# Altium project PX4FMUv2.4.6.PrjPcb (part 2 of 2)

## Sheet PX4FMUv2.4.6_12.SchDoc: PX4FMUv2.4.6.sch
size 282 x 200 mm; Date: 2015/3/26 21:06:25; SheetNumber: Sheet:
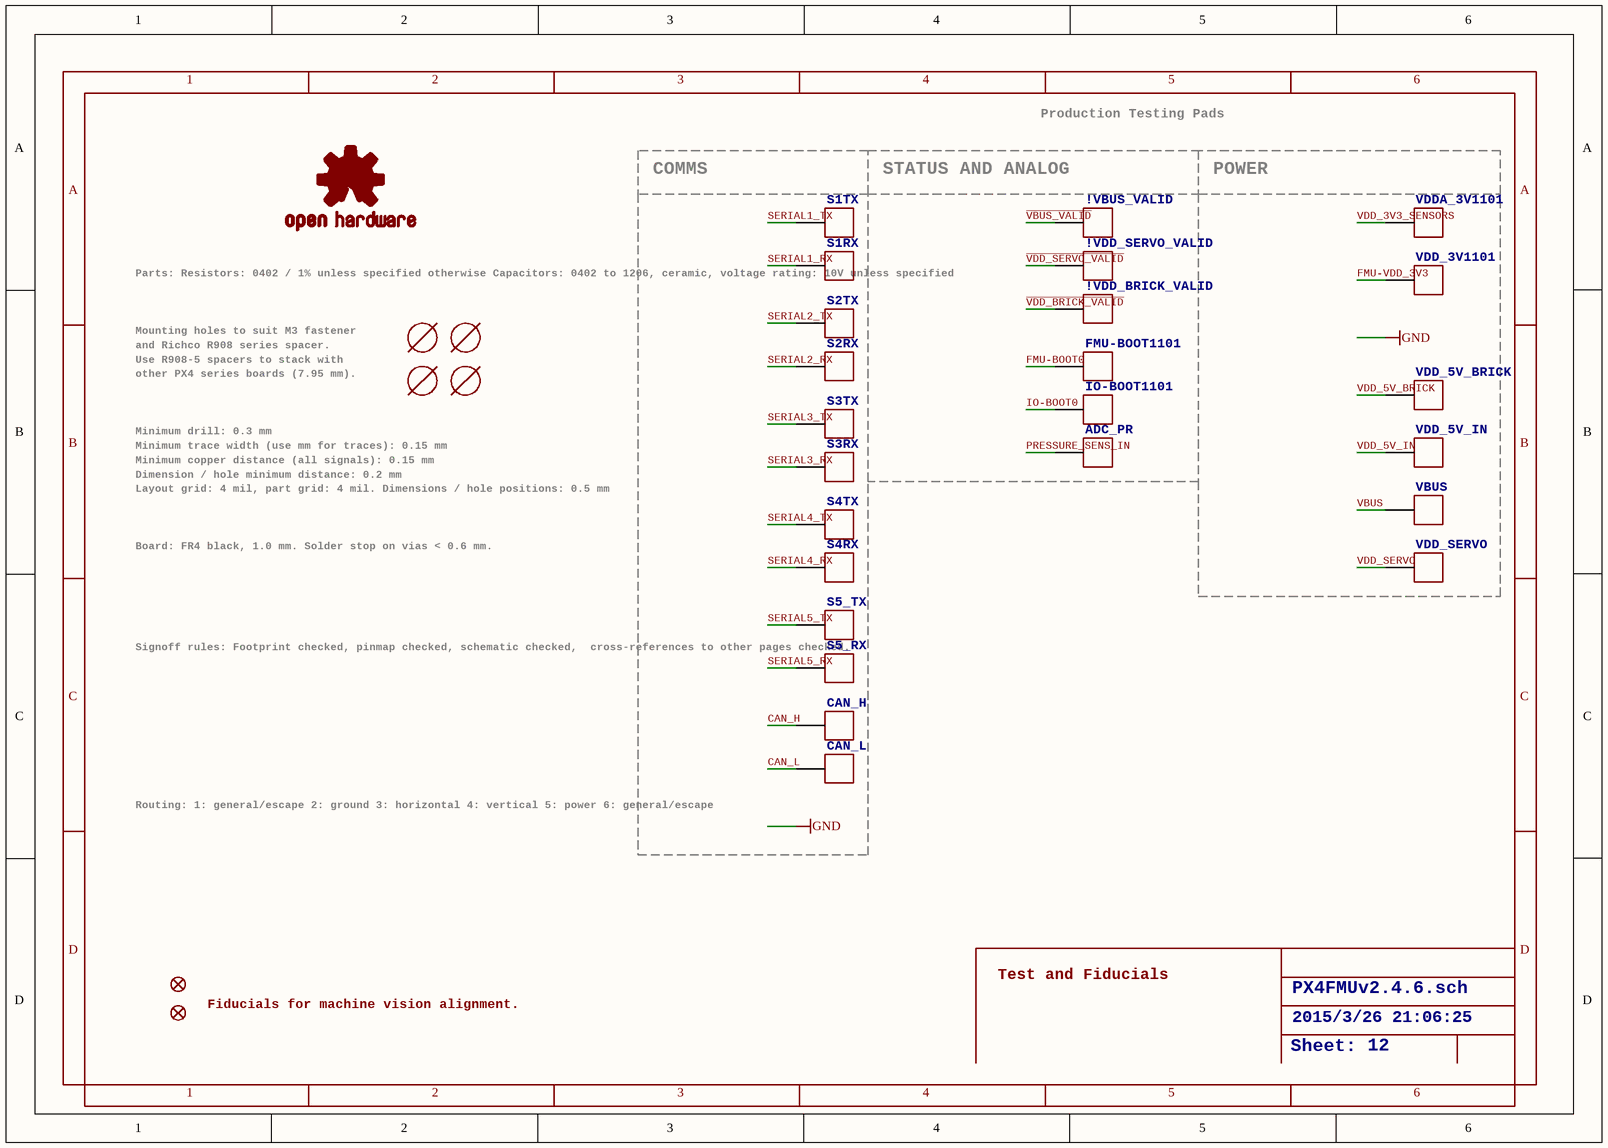
[diagram p11: PX4FMUv2.4.6_12.SchDoc]

### Parts
!VBUS_VALID  PAD.04  [PAD.04X.04]  (value not drawn)
!VDD_BRICK_VALID  PAD.04  [PAD.04X.04]  (value not drawn)
!VDD_SERVO_VALID  PAD.04  [PAD.04X.04]  (value not drawn)
ADC_PR  PAD.04  [PAD.04X.04]  (value not drawn)
CAN_H  PAD.04  [PAD.04X.04]  (value not drawn)
CAN_L  PAD.04  [PAD.04X.04]  (value not drawn)
FMU-BOOT1101  PAD.04  [PAD.04X.04]  (value not drawn)
IO-BOOT1101  PAD.04  [PAD.04X.04]  (value not drawn)
JP1  FIDUCIAL1.5X3  [FIDUCIAL-1.5X3]  (value not drawn)
JP2  FIDUCIAL1.5X3  [FIDUCIAL-1.5X3]  (value not drawn)
M3_MOUNT1101  MOUNT-HOLE3.1MM  [MOUNT-HOLE3.1]  (value not drawn)
M3_MOUNT1102  MOUNT-HOLE3.1MM  [MOUNT-HOLE3.1]  (value not drawn)
M3_MOUNT1103  MOUNT-HOLE3.1MM  [MOUNT-HOLE3.1]  (value not drawn)
M3_MOUNT1104  MOUNT-HOLE3.1MM  [MOUNT-HOLE3.1]  (value not drawn)
OSHW_LOGO  OSHW-LOGOS  [OSHW-LOGO-S]  (value not drawn)
S1RX  PAD.04  [PAD.04X.04]  (value not drawn)
S1TX  PAD.04  [PAD.04X.04]  (value not drawn)
S2RX  PAD.04  [PAD.04X.04]  (value not drawn)
S2TX  PAD.04  [PAD.04X.04]  (value not drawn)
S3RX  PAD.04  [PAD.04X.04]  (value not drawn)
S3TX  PAD.04  [PAD.04X.04]  (value not drawn)
S4RX  PAD.04  [PAD.04X.04]  (value not drawn)
S4TX  PAD.04  [PAD.04X.04]  (value not drawn)
S5_RX  PAD.04  [PAD.04X.04]  (value not drawn)
S5_TX  PAD.04  [PAD.04X.04]  (value not drawn)
VBUS  PAD.04  [PAD.04X.04]  (value not drawn)
VDD_3V1101  PAD.04  [PAD.04X.04]  (value not drawn)
VDD_5V_BRICK  PAD.04  [PAD.04X.04]  (value not drawn)
VDD_5V_IN  PAD.04  [PAD.04X.04]  (value not drawn)
VDD_SERVO  PAD.04  [PAD.04X.04]  (value not drawn)
VDDA_3V1101  PAD.04  [PAD.04X.04]  (value not drawn)

### Nets
CAN_H: CAN_H.P$1
CAN_L: CAN_L.P$1
FMU-BOOT0: FMU-BOOT1101.P$1
FMU-VDD_3V3: VDD_3V1101.P$1
IO-BOOT0: IO-BOOT1101.P$1
PRESSURE_SENS_IN: ADC_PR.P$1
SERIAL1_RX: S1RX.P$1
SERIAL1_TX: S1TX.P$1
SERIAL2_RX: S2RX.P$1
SERIAL2_TX: S2TX.P$1
SERIAL3_RX: S3RX.P$1
SERIAL3_TX: S3TX.P$1
SERIAL4_RX: S4RX.P$1
SERIAL4_TX: S4TX.P$1
SERIAL5_RX: S5_RX.P$1
SERIAL5_TX: S5_TX.P$1
~{VBUS_VALID}: !VBUS_VALID.P$1
~{VDD_BRICK_VALID}: !VDD_BRICK_VALID.P$1
~{VDD_SERVO_VALID}: !VDD_SERVO_VALID.P$1
VBUS: VBUS.P$1
VDD_3V3_SENSORS: VDDA_3V1101.P$1
VDD_5V_BRICK: VDD_5V_BRICK.P$1
VDD_5V_IN: VDD_5V_IN.P$1
VDD_SERVO: VDD_SERVO.P$1

### Notes on the sheet
- Production Testing Pads
- COMMS
- STATUS AND ANALOG
- POWER
- Parts:
  Resistors: 0402 / 1% unless specified otherwise
  Capacitors: 0402 to 1206, ceramic, voltage rating: 10V unless specified
- Mounting holes to suit M3 fastener
- and Richco R908 series spacer.
- Use R908-5 spacers to stack with
- other PX4 series boards (7.95 mm).
- Minimum drill: 0.3 mm
- Minimum trace width (use mm for traces): 0.15 mm
- Minimum copper distance (all signals): 0.15 mm
- Dimension / hole minimum distance: 0.2 mm
- Layout grid: 4 mil, part grid: 4 mil. Dimensions / hole positions: 0.5 mm
- Board: FR4 black, 1.0 mm. Solder stop on vias < 0.6 mm.
- Signoff rules: Footprint checked,
  pinmap checked,
  schematic checked,
  cross-references to
  other pages checked.
- Routing:
  1: general/escape
  2: ground
  3: horizontal
  4: vertical
  5: power
  6: general/escape
- Fiducials for machine
  vision alignment.
- Test and Fiducials
- 1
- 2
- 3
- 4
- 5
- 6
- A
- B
- C
- D

### Library data of the parts
!VBUS_VALID !VDD_BRICK_VALID !VDD_SERVO_VALID ADC_PR CAN_H CAN_L FMU-BOOT1101 IO-BOOT1101 S1RX S1TX S2RX S2TX S3RX S3TX S4RX S4TX S5_RX S5_TX VBUS VDD_3V1101 VDD_5V_BRICK VDD_5V_IN VDD_SERVO VDDA_3V1101 = PAD.04: <h3>Test pad</h3> / This footprint includes three classes: The actual test pads, a pogo-pin footprint to mount the pogo-pin as through-hole part and a hole footprint which allows the head of the pogo-pin to pass through (do NOT use the hole to mount the pogo-pin). In a typical test setup, the stack would consist of three PCBs: The actual PCB under testing with a test pad on the bottom, then a second PCB with the hole for the pogo-pin head where the PCB under testing is pressed on and a third PCB at 30 mm / 1.2" distance with the pogo-pin footprints. The pogo-pins are soldered to the last PCB. To create the stack, copy the board under testing and exchange the footprints - this way the correct positioning is ensured.; BOM: EXCLUDE; PARTNO: *
JP1 JP2 = FIDUCIAL1.5X3: <b>Fiducial Alignment Points</b> / Various fiducial points for machine vision alignment.; BOM: EXCLUDE; PARTNO: *
M3_MOUNT1101-M3_MOUNT1104 = MOUNT-HOLE3.1MM: BOM: EXCLUDE; PARTNO: *
OSHW_LOGO = OSHW-LOGOS: <b>Open Source Hardware Logo</b> This logo indicates the piece of hardware it is found on incorporates a OSHW license and/or adheres to the definition of open source hardware found here: http://freedomdefined.org/OSHW; BOM: EXCLUDE; PARTNO: *

## Nets that join several sheets
GND: PX4FMUv2.4.6_01 (7 pins), PX4FMUv2.4.6_02 (14 pins), PX4FMUv2.4.6_03 (11 pins), PX4FMUv2.4.6_04 (20 pins), PX4FMUv2.4.6_05 (31 pins), PX4FMUv2.4.6_06 (34 pins), PX4FMUv2.4.6_07 (14 pins), PX4FMUv2.4.6_08 (21 pins), PX4FMUv2.4.6_09 (13 pins), PX4FMUv2.4.6_10 (12 pins), PX4FMUv2.4.6_11 (21 pins)
~{ACCEL_MAG_CS}: PX4FMUv2.4.6_01 (U101.9), PX4FMUv2.4.6_05 (U504.8 X503.6)
ACCEL_DRDY: PX4FMUv2.4.6_01 (U101.90), PX4FMUv2.4.6_05 (U504.11 X503.3)
ALARM: PX4FMUv2.4.6_01 (U101.77), PX4FMUv2.4.6_07 (R701.P$2)
~{BARO_CS}: PX4FMUv2.4.6_01 (U101.88), PX4FMUv2.4.6_05 (U506.5)
BATT_CURRENT_SENS: PX4FMUv2.4.6_01 (U101.26), PX4FMUv2.4.6_11 (R1101.P$1)
BATT_VOLTAGE_SENS: PX4FMUv2.4.6_01 (U101.25), PX4FMUv2.4.6_11 (R1102.P$1)
CAN1_RX: PX4FMUv2.4.6_01 (U101.81), PX4FMUv2.4.6_04 (U401.4)
CAN1_TX: PX4FMUv2.4.6_01 (U101.82), PX4FMUv2.4.6_04 (U401.1)
CAN2_RX: PX4FMUv2.4.6_01 (U101.51), PX4FMUv2.4.6_02 (R216.P$1)
CAN2_TX: PX4FMUv2.4.6_01 (U101.92), PX4FMUv2.4.6_02 (R215.P$1)
CAN_H: PX4FMUv2.4.6_04 (J405.2 R409.P$1 U401.7), PX4FMUv2.4.6_12 (CAN_H.P$1)
CAN_L: PX4FMUv2.4.6_04 (J405.3 R409.P$2 U401.6), PX4FMUv2.4.6_12 (CAN_L.P$1)
~{FMU-LED_AMBER}: PX4FMUv2.4.6_01 (U101.43), PX4FMUv2.4.6_07 (R707.P$1)
FMU-!RESET: PX4FMUv2.4.6_06 (5 pins), PX4FMUv2.4.6_07 (U701.4)
FMU-BOOT0: PX4FMUv2.4.6_06 (R611.P$2 U101.94), PX4FMUv2.4.6_12 (FMU-BOOT1101.P$1)
FMU-CH1: PX4FMUv2.4.6_01 (U101.45), PX4FMUv2.4.6_09 (U901.7)
FMU-CH2: PX4FMUv2.4.6_01 (U101.44), PX4FMUv2.4.6_09 (U901.6)
FMU-CH3: PX4FMUv2.4.6_01 (U101.42), PX4FMUv2.4.6_09 (U901.5)
FMU-CH4: PX4FMUv2.4.6_01 (U101.40), PX4FMUv2.4.6_09 (U901.4)
FMU-CH5: PX4FMUv2.4.6_01 (U101.60), PX4FMUv2.4.6_09 (U901.3)
FMU-CH6: PX4FMUv2.4.6_01 (U101.61), PX4FMUv2.4.6_09 (U901.1)
FMU-I2C1_SCL: PX4FMUv2.4.6_01 (U101.95), PX4FMUv2.4.6_04 (R401.P$1 R404.P$1)
FMU-I2C1_SDA: PX4FMUv2.4.6_01 (U101.96), PX4FMUv2.4.6_04 (R402.P$1 R405.P$1)
FMU-I2C2_SCL: PX4FMUv2.4.6_01 (U101.47), PX4FMUv2.4.6_03 (R306.P$1), PX4FMUv2.4.6_07 (U701.3)
FMU-I2C2_SDA: PX4FMUv2.4.6_01 (U101.48), PX4FMUv2.4.6_03 (R307.P$1), PX4FMUv2.4.6_07 (U701.2)
FMU-SWCLK: PX4FMUv2.4.6_01 (U101.76), PX4FMUv2.4.6_03 (JX301.4)
FMU-SWDIO: PX4FMUv2.4.6_01 (U101.72), PX4FMUv2.4.6_03 (JX301.2)
FMU-SWO: PX4FMUv2.4.6_01 (U101.89), PX4FMUv2.4.6_03 (JX301.6)
FMU-UART4_RX: PX4FMUv2.4.6_01 (U101.24), PX4FMUv2.4.6_02 (U202.8)
FMU-UART4_TX: PX4FMUv2.4.6_01 (U101.23), PX4FMUv2.4.6_02 (U202.9)
FMU-UART7_RX: PX4FMUv2.4.6_01 (U101.38), PX4FMUv2.4.6_02 (U202.4)
FMU-UART7_TX: PX4FMUv2.4.6_01 (U101.39), PX4FMUv2.4.6_02 (U202.5)
FMU-UART8_RX: PX4FMUv2.4.6_01 (U101.97), PX4FMUv2.4.6_02 (U202.6)
FMU-UART8_TX: PX4FMUv2.4.6_01 (U101.98), PX4FMUv2.4.6_02 (U202.7)
FMU-USART2_CTS: PX4FMUv2.4.6_01 (U101.84), PX4FMUv2.4.6_02 (U201.9)
FMU-USART2_RTS: PX4FMUv2.4.6_01 (U101.85), PX4FMUv2.4.6_02 (U201.8)
FMU-USART2_RX: PX4FMUv2.4.6_01 (U101.87), PX4FMUv2.4.6_02 (U201.6)
FMU-USART2_TX: PX4FMUv2.4.6_01 (U101.86), PX4FMUv2.4.6_02 (U201.7)
FMU-USART3_CTS: PX4FMUv2.4.6_01 (U101.58), PX4FMUv2.4.6_02 (U201.3)
FMU-USART3_RTS: PX4FMUv2.4.6_01 (U101.59), PX4FMUv2.4.6_02 (U201.1)
FMU-USART3_RX: PX4FMUv2.4.6_01 (U101.56), PX4FMUv2.4.6_02 (U201.4)
FMU-USART3_TX: PX4FMUv2.4.6_01 (U101.55), PX4FMUv2.4.6_02 (U201.5)
FMU-VDD_3V3: PX4FMUv2.4.6_01 (C101.P$1 U102.3 U102.7 U102.8), PX4FMUv2.4.6_02 (8 pins), PX4FMUv2.4.6_03 (9 pins), PX4FMUv2.4.6_04 (C402.P$1 R401.P$2 R402.P$2 U401.3), PX4FMUv2.4.6_06 (15 pins), PX4FMUv2.4.6_07 (C701.P$1 U701.1 U701.10), PX4FMUv2.4.6_09 (C902.P$1 U901.2 U901.10 U901.19), PX4FMUv2.4.6_12 (VDD_3V1101.P$1)
FMU_AUX_ADC1: PX4FMUv2.4.6_01 (U101.18), PX4FMUv2.4.6_04 (R408.P$1)
FMU_AUX_ADC2: PX4FMUv2.4.6_01 (U101.33), PX4FMUv2.4.6_04 (R407.P$1)
~{GYRO_CS}: PX4FMUv2.4.6_01 (U101.7), PX4FMUv2.4.6_05 (U501.5 U502.5 X503.7)
GPIO_EXT_1: PX4FMUv2.4.6_01 (U101.8), PX4FMUv2.4.6_04 (J403.6)
GYRO_DRDY: PX4FMUv2.4.6_01 (U101.35), PX4FMUv2.4.6_05 (U501.6 U502.6 X503.5)
~{IO-LED_AMBER}: PX4FMUv2.4.6_07 (R709.P$1), PX4FMUv2.4.6_08 (U801.28)
~{IO-LED_BLUE}: PX4FMUv2.4.6_07 (R712.P$1), PX4FMUv2.4.6_08 (U801.27)
~{IO-LED_SAFETY}: PX4FMUv2.4.6_07 (R710.P$2), PX4FMUv2.4.6_08 (U801.26)
IO-!RESET: PX4FMUv2.4.6_08 (C801.P$2 S801.A1 U801.7), PX4FMUv2.4.6_10 (U1002.3)
IO-!VDD_SERVO_IN_FAULT: PX4FMUv2.4.6_08 (U801.38), PX4FMUv2.4.6_10 (U1001.4)
IO-BOOT0: PX4FMUv2.4.6_08 (R801.P$1 U801.44), PX4FMUv2.4.6_12 (IO-BOOT1101.P$1)
IO-CH1: PX4FMUv2.4.6_08 (U801.10), PX4FMUv2.4.6_09 (U902.9)
IO-CH2: PX4FMUv2.4.6_08 (U801.11), PX4FMUv2.4.6_09 (U902.8)
IO-CH3: PX4FMUv2.4.6_08 (U801.45), PX4FMUv2.4.6_09 (U902.7)
IO-CH4: PX4FMUv2.4.6_08 (U801.46), PX4FMUv2.4.6_09 (U902.6)
IO-CH5: PX4FMUv2.4.6_08 (U801.16), PX4FMUv2.4.6_09 (U902.5)
IO-CH6: PX4FMUv2.4.6_08 (U801.17), PX4FMUv2.4.6_09 (U902.4)
IO-CH7: PX4FMUv2.4.6_08 (U801.18), PX4FMUv2.4.6_09 (U902.3)
IO-CH8: PX4FMUv2.4.6_08 (U801.19), PX4FMUv2.4.6_09 (U902.1)
IO-USART1_TX: PX4FMUv2.4.6_01 (R101.P$2), PX4FMUv2.4.6_08 (JX801.1 U801.30)
IO-VDD_3V3: PX4FMUv2.4.6_07 (D701.C J702.1), PX4FMUv2.4.6_08 (8 pins), PX4FMUv2.4.6_09 (6 pins), PX4FMUv2.4.6_10 (C1003.P$1 C1004.P$1 U1002.7)
IO-VDD_5V5: PX4FMUv2.4.6_07 (LED702.A LED703.A LED705.A), PX4FMUv2.4.6_10 (5 pins)
~{MPU_CS}: PX4FMUv2.4.6_01 (U101.17), PX4FMUv2.4.6_05 (U505.8)
MAG_DRDY: PX4FMUv2.4.6_01 (U101.36), PX4FMUv2.4.6_05 (U504.9 X503.4)
MPU_DRDY: PX4FMUv2.4.6_01 (U101.62), PX4FMUv2.4.6_05 (U505.12)
OTG_FS_DM: PX4FMUv2.4.6_01 (U101.70), PX4FMUv2.4.6_03 (U302.6)
OTG_FS_DP: PX4FMUv2.4.6_01 (U101.71), PX4FMUv2.4.6_03 (U302.4)
PPM_INPUT: PX4FMUv2.4.6_08 (U801.29), PX4FMUv2.4.6_09 (D901.C R909.P$1 U903.2)
PRESSURE_SENS: PX4FMUv2.4.6_01 (U101.34), PX4FMUv2.4.6_04 (C401.P$1 R403.P$2 R406.P$1)
PRESSURE_SENS_IN: PX4FMUv2.4.6_04 (J402.2 R406.P$2), PX4FMUv2.4.6_12 (ADC_PR.P$1)
RSSI_IN: PX4FMUv2.4.6_08 (U801.15 U801.33), PX4FMUv2.4.6_09 (R901.P$1)
RX-VDD_5V5: PX4FMUv2.4.6_09 (J901.2), PX4FMUv2.4.6_10 (F1001.1)
~{SBUS_OUTPUT_EN}: PX4FMUv2.4.6_08 (U801.40), PX4FMUv2.4.6_09 (U903.7)
~{SPI_EXT_NSS}: PX4FMUv2.4.6_01 (U101.3), PX4FMUv2.4.6_04 (J403.5)
SAFETY: PX4FMUv2.4.6_07 (J702.3 R713.P$1), PX4FMUv2.4.6_08 (U801.41)
SBUS_INPUT: PX4FMUv2.4.6_08 (U801.22), PX4FMUv2.4.6_09 (U903.6)
SBUS_OUTPUT: PX4FMUv2.4.6_08 (U801.21), PX4FMUv2.4.6_09 (U903.5)
SDIO_CK: PX4FMUv2.4.6_01 (U101.80), PX4FMUv2.4.6_03 (U301.5)
SDIO_CMD: PX4FMUv2.4.6_01 (U101.83), PX4FMUv2.4.6_03 (R303.P$1 U301.3)
SDIO_D0: PX4FMUv2.4.6_01 (U101.65), PX4FMUv2.4.6_03 (R304.P$1 U301.7)
SDIO_D1: PX4FMUv2.4.6_01 (U101.66), PX4FMUv2.4.6_03 (R305.P$1 U301.8)
SDIO_D2: PX4FMUv2.4.6_01 (U101.78), PX4FMUv2.4.6_03 (R301.P$1 U301.1)
SDIO_D3: PX4FMUv2.4.6_01 (U101.79), PX4FMUv2.4.6_03 (R302.P$1 U301.2)
SERIAL1_RX: PX4FMUv2.4.6_02 (J201.3 R203.P$2), PX4FMUv2.4.6_12 (S1RX.P$1)
SERIAL1_TX: PX4FMUv2.4.6_02 (J201.2 R210.P$2), PX4FMUv2.4.6_12 (S1TX.P$1)
SERIAL2_RX: PX4FMUv2.4.6_02 (J202.3 R202.P$2), PX4FMUv2.4.6_12 (S2RX.P$1)
SERIAL2_TX: PX4FMUv2.4.6_02 (J202.2 R209.P$2), PX4FMUv2.4.6_12 (S2TX.P$1)
SERIAL3_RX: PX4FMUv2.4.6_02 (J203.3 R207.P$2), PX4FMUv2.4.6_12 (S3RX.P$1)
SERIAL3_TX: PX4FMUv2.4.6_02 (J203.2 R214.P$2), PX4FMUv2.4.6_12 (S3TX.P$1)
SERIAL4_RX: PX4FMUv2.4.6_02 (J204.3 R206.P$2), PX4FMUv2.4.6_12 (S4RX.P$1)
SERIAL4_TX: PX4FMUv2.4.6_02 (J204.2 R213.P$2), PX4FMUv2.4.6_12 (S4TX.P$1)
SERIAL5_RX: PX4FMUv2.4.6_02 (J204.5 R205.P$2), PX4FMUv2.4.6_12 (S5_RX.P$1)
SERIAL5_TX: PX4FMUv2.4.6_02 (J204.4 R212.P$2), PX4FMUv2.4.6_12 (S5_TX.P$1)
SERIAL_FMU_TO_IO: PX4FMUv2.4.6_01 (U101.63), PX4FMUv2.4.6_08 (R804.P$2)
SERIAL_IO_TO_FMU: PX4FMUv2.4.6_01 (U101.64), PX4FMUv2.4.6_08 (R803.P$2)
SPI_EXT_MISO: PX4FMUv2.4.6_01 (U101.4), PX4FMUv2.4.6_04 (J403.3)
SPI_EXT_MOSI: PX4FMUv2.4.6_01 (U101.5), PX4FMUv2.4.6_04 (J403.4)
SPI_EXT_SCK: PX4FMUv2.4.6_01 (U101.1), PX4FMUv2.4.6_04 (J403.2)
SPI_INT_MISO: PX4FMUv2.4.6_01 (U101.31), PX4FMUv2.4.6_05 (6 pins)
SPI_INT_MOSI: PX4FMUv2.4.6_01 (U101.32), PX4FMUv2.4.6_05 (6 pins)
SPI_INT_SCK: PX4FMUv2.4.6_01 (U101.30), PX4FMUv2.4.6_05 (6 pins)
~{VBUS_VALID}: PX4FMUv2.4.6_01 (U101.15), PX4FMUv2.4.6_11 (RN1101.2 U1101.P$9), PX4FMUv2.4.6_12 (!VBUS_VALID.P$1)
~{VDD_5V_HIPOWER_OC}: PX4FMUv2.4.6_01 (U101.41), PX4FMUv2.4.6_06 (R602.P$1 U601.4)
~{VDD_5V_PERIPH_EN}: PX4FMUv2.4.6_01 (U101.67), PX4FMUv2.4.6_06 (R615.P$1 U601.5 U602.5)
~{VDD_5V_PERIPH_OC}: PX4FMUv2.4.6_01 (U101.46), PX4FMUv2.4.6_06 (R604.P$1 U602.4)
~{VDD_BRICK_VALID}: PX4FMUv2.4.6_01 (U101.91), PX4FMUv2.4.6_11 (RN1101.4 U1101.P$7), PX4FMUv2.4.6_12 (!VDD_BRICK_VALID.P$1)
~{VDD_SERVO_VALID}: PX4FMUv2.4.6_01 (U101.93), PX4FMUv2.4.6_11 (RN1101.3 U1101.P$8), PX4FMUv2.4.6_12 (!VDD_SERVO_VALID.P$1)
VBAT: PX4FMUv2.4.6_06 (B601.1 R608.P$1 U101.6), PX4FMUv2.4.6_08 (U801.1)
VBUS: PX4FMUv2.4.6_01 (U101.68), PX4FMUv2.4.6_03 (J301.VBUS J302.1 U302.5), PX4FMUv2.4.6_11 (C1103.P$1 R1112.P$1 U1101.P$19 U1104.P$7 P$8), PX4FMUv2.4.6_12 (VBUS.P$1)
VDD_3V3_SENSORS: PX4FMUv2.4.6_05 (19 pins), PX4FMUv2.4.6_06 (C605.P$1 C617.P$1 Q601.E U603.8), PX4FMUv2.4.6_12 (VDDA_3V1101.P$1)
VDD_3V3_SENSORS_EN: PX4FMUv2.4.6_01 (U101.2), PX4FMUv2.4.6_06 (R603.P$2 R620.P$2 R635.P$2 U603.5)
VDD_3V3_SPEKTRUM: PX4FMUv2.4.6_08 (D801.C J801.P$1), PX4FMUv2.4.6_10 (C1008.P$1 U1002.8)
VDD_3V3_SPEKTRUM_EN: PX4FMUv2.4.6_08 (U801.2), PX4FMUv2.4.6_10 (R1002.P$2 U1002.5)
VDD_5V_BRICK: PX4FMUv2.4.6_11 (6 pins), PX4FMUv2.4.6_12 (VDD_5V_BRICK.P$1)
VDD_5V_HIPOWER: PX4FMUv2.4.6_02 (L201.P$1), PX4FMUv2.4.6_06 (C614.P$1 U601.8)
VDD_5V_IN: PX4FMUv2.4.6_06 (L603.P$1 R609.P$2 U601.1 U602.1), PX4FMUv2.4.6_07 (8 pins), PX4FMUv2.4.6_10 (D1001.1 D1002.1), PX4FMUv2.4.6_11 (8 pins), PX4FMUv2.4.6_12 (VDD_5V_IN.P$1)
VDD_5V_PERIPH: PX4FMUv2.4.6_02 (L202.P$1 L203.P$1), PX4FMUv2.4.6_04 (L401.P$1 L402.P$1 L403.P$1 L404.P$1), PX4FMUv2.4.6_06 (C618.P$1 U602.8)
VDD_5V_SENS: PX4FMUv2.4.6_01 (U101.29), PX4FMUv2.4.6_06 (R609.P$1 R610.P$1)
VDD_SERVO: PX4FMUv2.4.6_09 (D904.ANODE J901.5 8 11 14 17 20 23 26 29 32 35 38 41 44 47 R922.P$2), PX4FMUv2.4.6_11 (C1102.P$1 R1109.P$1 U1101.P$20 U1103.P$7 P$8), PX4FMUv2.4.6_12 (VDD_SERVO.P$1)
VDD_SERVO_IN: PX4FMUv2.4.6_09 (L901.P$2), PX4FMUv2.4.6_10 (U1001.1)
VDD_SERVO_SENS: PX4FMUv2.4.6_08 (U801.14), PX4FMUv2.4.6_09 (R918.P$1 R919.P$2)